# EAGLE design shield (EAGLE 6.6.0)
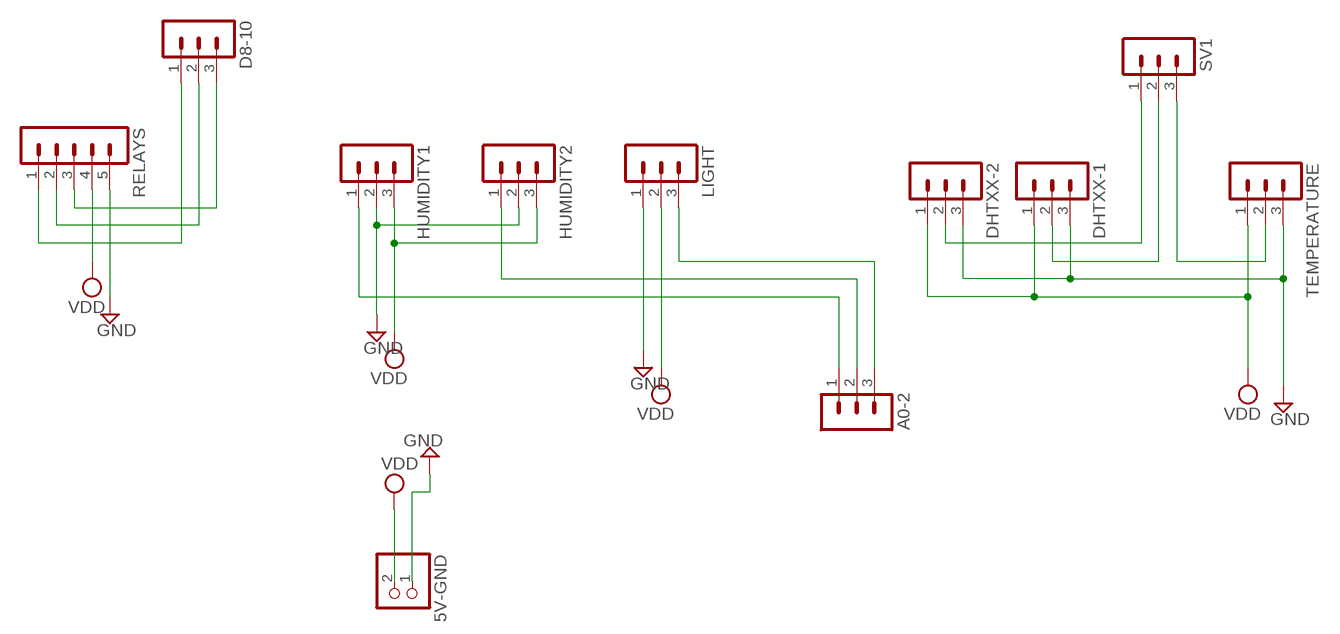
[diagram p0: schematic, sheet 1]

## Parts
5V-GND  PINHD-1X2  [1X02]
A0-2  MA03-1  [MA03-1]
D8-10  MA03-1  [MA03-1]
DHTXX-1  MA03-1  [MA03-1]
DHTXX-2  MA03-1  [MA03-1]
HUMIDITY1  MA03-1  [MA03-1]
HUMIDITY2  MA03-1  [MA03-1]
LIGHT  MA03-1  [MA03-1]
RELAYS  MA05-1  [MA05-1]
SV1  MA03-1  [MA03-1]
TEMPERATURE  MA03-1  [MA03-1]

## Nets
GND: 5V-GND.1 DHTXX-1.3 DHTXX-2.3 HUMIDITY1.2 HUMIDITY2.2 LIGHT.1 RELAYS.5 TEMPERATURE.3
N$1: DHTXX-1.2 SV1.2
N$2: SV1.3 TEMPERATURE.2
N$3: A0-2.1 HUMIDITY1.1
N$4: D8-10.2 RELAYS.2
N$5: A0-2.2 HUMIDITY2.1
N$6: D8-10.1 RELAYS.1
N$7: A0-2.3 LIGHT.3
N$8: D8-10.3 RELAYS.3
N$9: DHTXX-2.2 SV1.1
VDD: 5V-GND.2 DHTXX-1.1 DHTXX-2.1 HUMIDITY1.3 HUMIDITY2.3 LIGHT.2 RELAYS.4 TEMPERATURE.1

## Library data of the parts
5V-GND = pinhead:PINHD-1X2: PIN HEADER
A0-2 D8-10 DHTXX-1 DHTXX-2 HUMIDITY1 HUMIDITY2 LIGHT SV1 TEMPERATURE = con-lstb:MA03-1: PIN HEADER; OC_FARNELL: unknown; OC_NEWARK: unknown
RELAYS = con-lstb:MA05-1: PIN HEADER; OC_FARNELL: unknown; OC_NEWARK: unknown

## Board
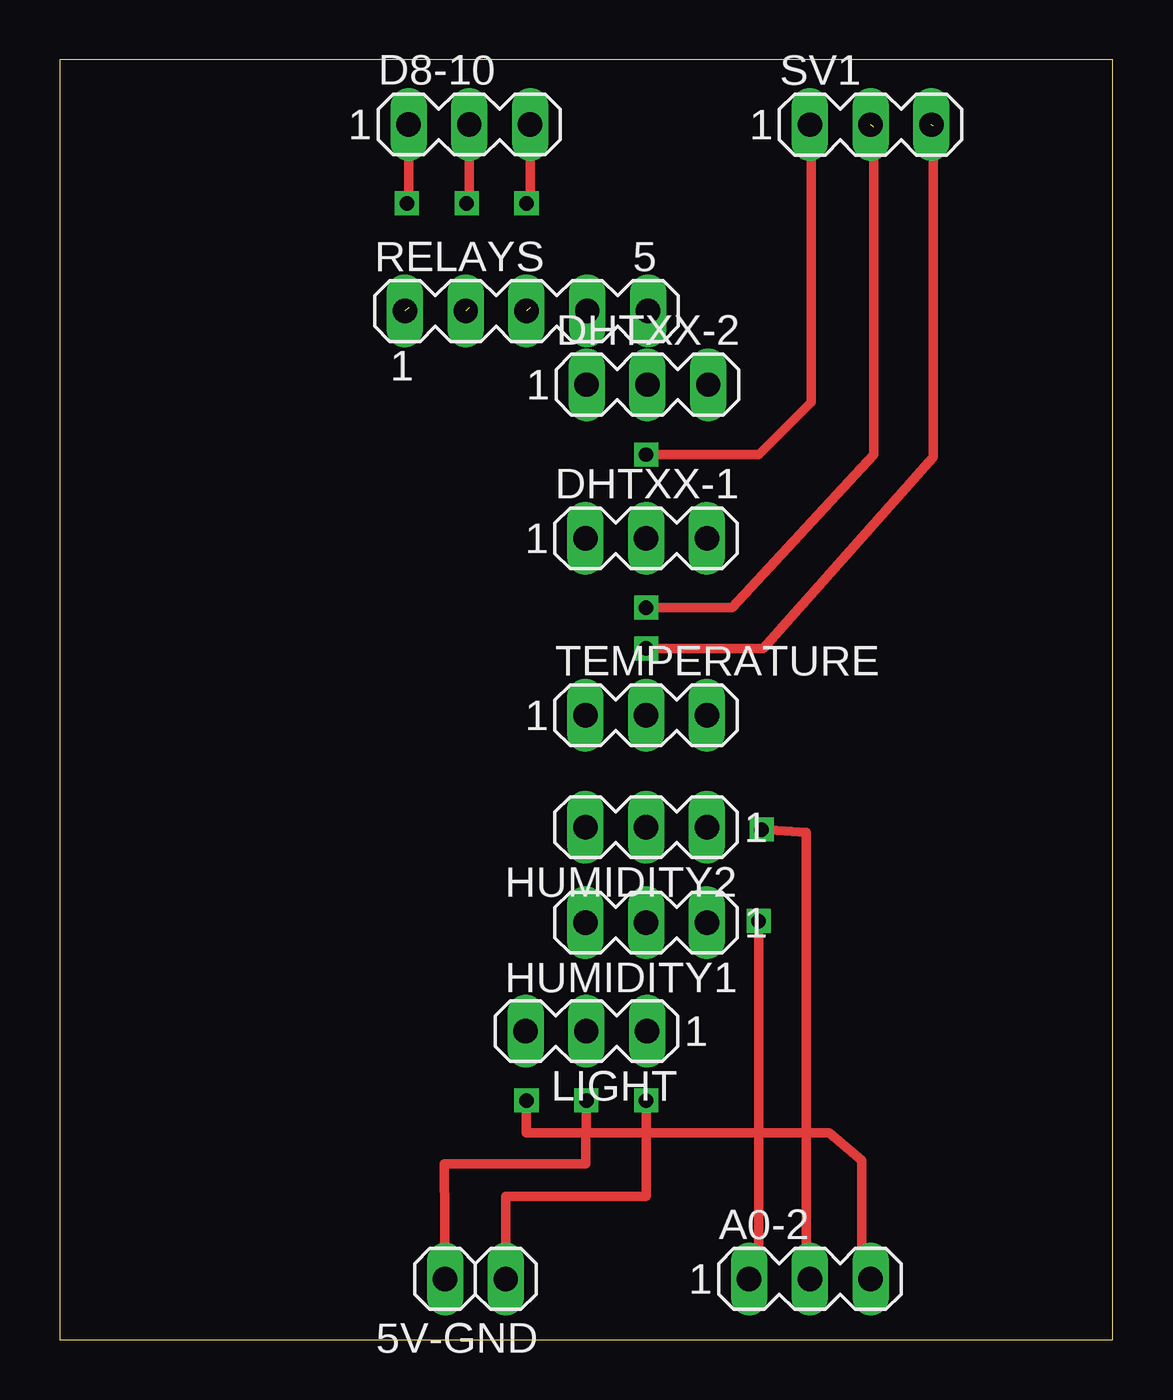
[diagram p1: board, top side]
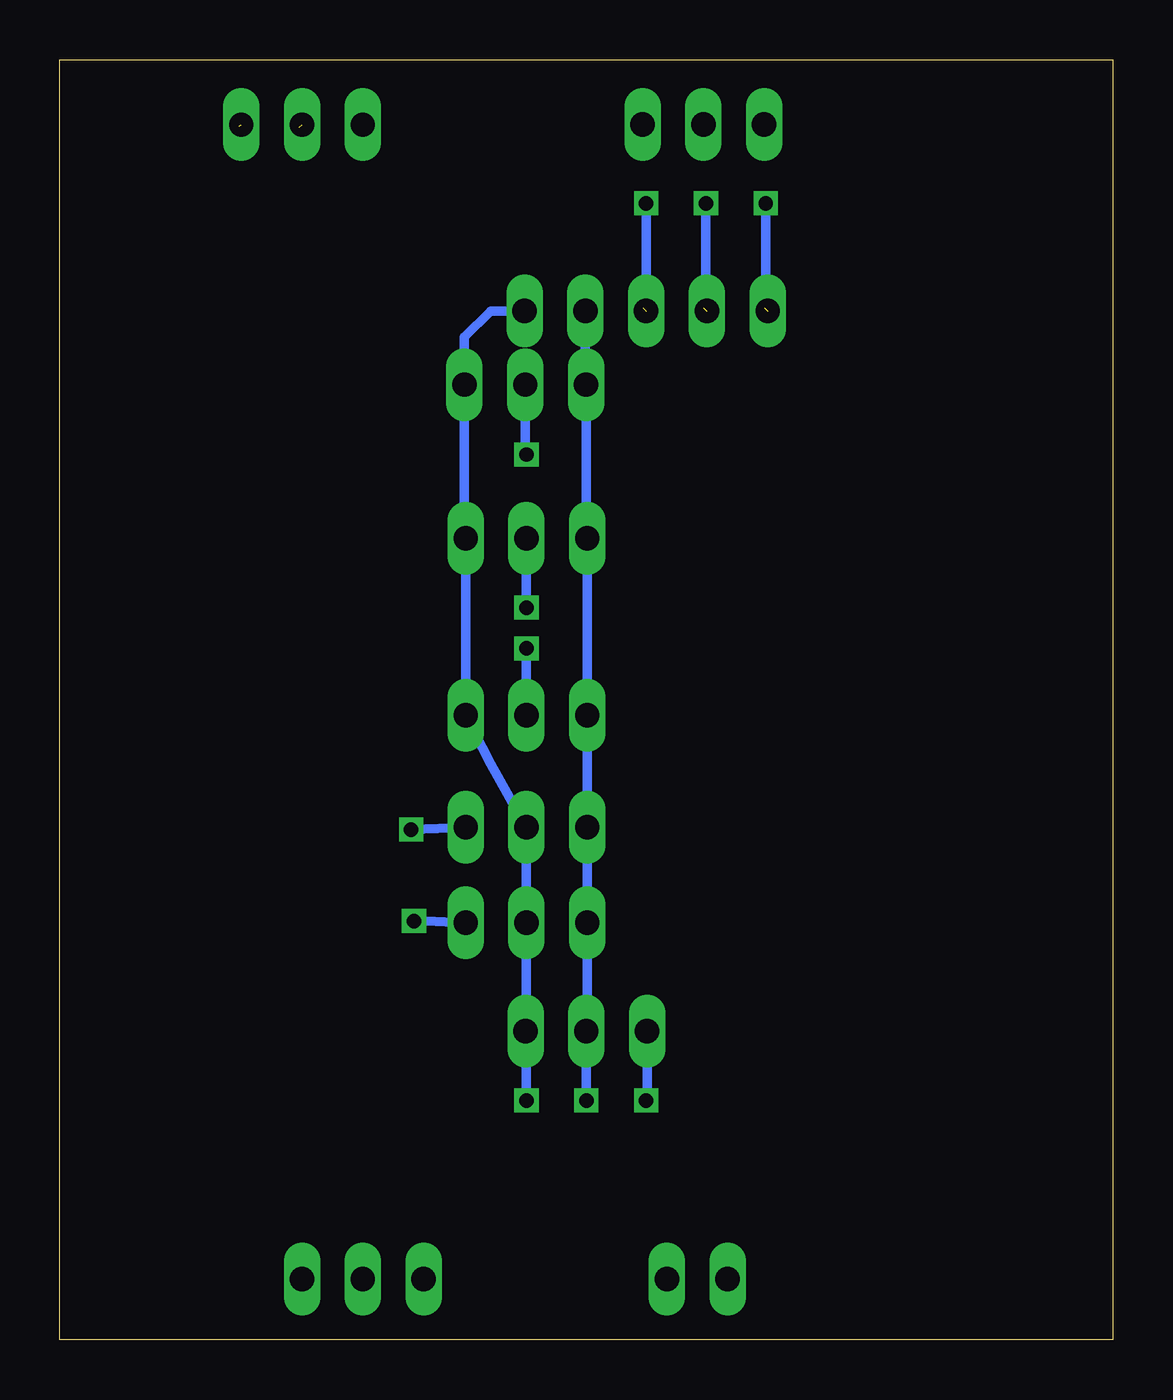
[diagram p2: board, bottom side, seen from below]

Size 44 x 53.5 mm. Coordinates in mm from the lower left corner, seen from the top.
Outline: 0,0 44,0 44,53.5 0,53.5 0,0
Copper layers (1*16): Top 0.035mm / dielectric 1.5mm / Bottom 0.035mm
Design rules "default": minimum track width 10mil, minimum drill 24mil, track to track 8mil, track to pad 8mil, pad to pad 8mil, via to via 8mil, smd to smd 8mil, copper to edge 40mil, drill to drill 8mil, minimum pad ring 10mil, minimum via ring 8mil, stop-mask expansion 4mil, vias tented up to drill 0mil, thermal gap 10mil

### Footprints (pad centres in the part's own frame; a part is rotated, then mirrored left to right if it is on the bottom)
1X02 = drill 1.016 long: 1 -1.27,0; 2 1.27,0
MA03-1 = drill 1.016 long: 1 -2.54,0; 2 0,0; 3 2.54,0
MA05-1 = drill 1.016 long: 1 -5.08,0; 2 -2.54,0; 3 0,0; 4 2.54,0; 5 5.08,0

### Placement (x,y rotation side)
5V-GND  17.37,2.54 180 top
A0-2  31.34,2.54 0 top
D8-10  17.11,50.8 0 top
DHTXX-1  24.5,33.5 0 top
DHTXX-2  24.55,39.92 0 top
HUMIDITY1  24.5,17.43 180 top
HUMIDITY2  24.5,21.42 180 top
LIGHT  22,12.9 180 top
RELAYS  19.5,43 0 top
SV1  33.88,50.79 0 top
TEMPERATURE  24.5,26.1 0 top

### Tracks (layer width: path | path; a pad name or v marks a point on that pad's centre or on a via)
GND  (via drill 0.6)
  Top 0.406: v24.5,10 24.5,6 18.63,6 5V-GND.1
  Bottom 0.406: v24.5,10 24.5,13.9 LIGHT.1 24.5,13.94 HUMIDITY1.2 HUMIDITY2.2 26,24.06 TEMPERATURE.3 DHTXX-1.3 27.09,33.5 DHTXX-2.3 27.1,40.13 27.1,41.9 26,43 RELAYS.5
N$1  (via drill 0.6)  (1 unrouted)
  Top 0.406: v24.5,30.6 28.1,30.6 34,37 34,50.68
  Bottom 0.406: DHTXX-1.2 v24.5,30.6
N$2  (via drill 0.6)  (1 unrouted)
  Top 0.406: v24.5,28.9 29.4,28.9 36.5,36.9 36.5,50.72
  Bottom 0.406: TEMPERATURE.2 v24.5,28.9
N$3  (via drill 0.6)
  Top 0.406: v29.2,17.5 29.2,2.94 A0-2.1
  Bottom 0.406: HUMIDITY1.1 29.17,17.53 v29.2,17.5
N$4  (via drill 0.6)  (1 unrouted)
  Top 0.406: D8-10.2 17.11,47.61 v17,47.5
  Bottom 0.406: v17,47.5 17,43.04 RELAYS.2
N$5  (via drill 0.6)
  Top 0.406: v29.32,21.32 29.36,21.32 31.2,21.2 31.2,2.68 A0-2.2
  Bottom 0.406: HUMIDITY2.1 v29.32,21.32
N$6  (via drill 0.6)  (1 unrouted)
  Top 0.406: D8-10.1 14.57,47.57 v14.5,47.5
  Bottom 0.406: v14.5,47.5 14.5,43.08 RELAYS.1
N$7  (via drill 0.6)
  Top 0.406: v19.5,10 19.49,8.64 32.16,8.65 33.5,7.5 33.5,2.92 A0-2.3
  Bottom 0.406: LIGHT.3 19.46,10.04 v19.5,10
N$8  (via drill 0.6)  (1 unrouted)
  Top 0.406: D8-10.3 19.65,47.65 v19.5,47.5
  Bottom 0.406: v19.5,47.5 RELAYS.3
N$9  (via drill 0.6)
  Top 0.406: v24.5,37 29.2,37 31.4,39.2 31.4,50.73 SV1.1
  Bottom 0.406: DHTXX-2.2 24.55,37.05 v24.5,37
VDD  (via drill 0.6)
  Top 0.406: v22,10 21.97,7.35 16.07,7.35 5V-GND.2
  Bottom 0.406: v22,10 LIGHT.2 21.96,13.94 HUMIDITY1.3 HUMIDITY2.3 TEMPERATURE.1 DHTXX-1.1 22.01,33.5 DHTXX-2.1 22.04,40.15 RELAYS.4

### Text on the board
Top: This scheme is designed / for an one sided breadboard. / The top track are cables / and don't matter / if they are crossed.